# Altium schematic sheet Charger.SchDoc
size A4
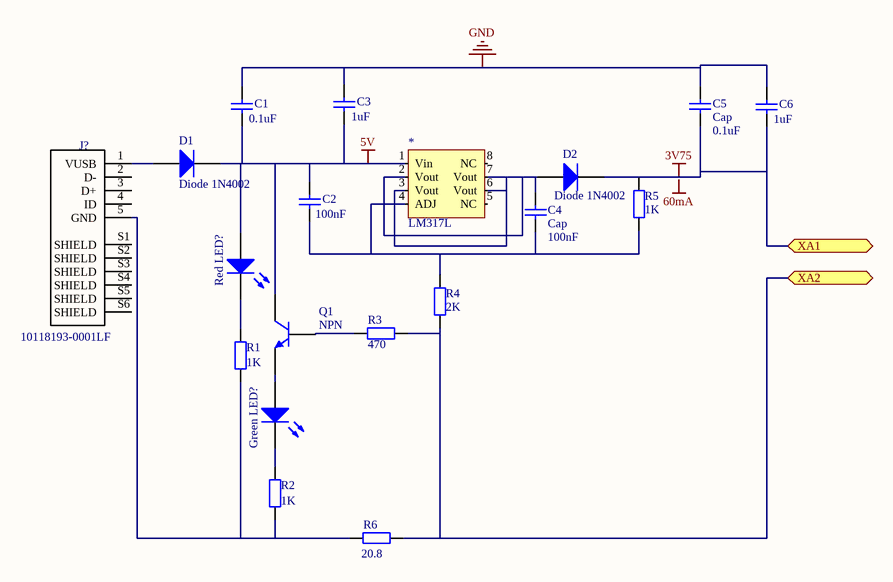
[diagram p0: Charger.SchDoc]

## Parts
*  LM317L  [*SOIC127P600X175-8N]
C1  value 0.1uF  [RAD-0.3]  (hidden comment: Cap)
C2  value 100nF  [RAD-0.3]  (hidden comment: Cap)
C3  value 1uF  [RAD-0.3]  (hidden comment: Cap)
C4  Cap  value 100nF  [RAD-0.3]
C5  Cap  value 0.1uF  [RAD-0.3]
C6  value 1uF  [RAD-0.3]  (hidden comment: Cap)
D1  Diode 1N4002  [DO-41]
D2  Diode 1N4002  [DO-41]
Green_LED?  (no value)  [3.2X1.6X1.1]
J?  10118193-0001LF  [*FCI_10118193-0001LF_10118193-0001LF(Primary)]
Q1  NPN  [*TO-92]
R1  value 1K  [AXIAL-0.4]  (hidden comment: Res2)
R2  value 1K  [AXIAL-0.4]  (hidden comment: Res2)
R3  value 470  [AXIAL-0.4]  (hidden comment: Res2)
R4  value 2K  [AXIAL-0.4]  (hidden comment: Res2)
R5  value 1K  [AXIAL-0.4]  (hidden comment: Res2)
R6  value 20.8  [AXIAL-0.4]  (hidden comment: Res2)
Red_LED?  (no value)  [LED-1]

## Ports
XA1, XA2

## Nets
3V75: C5.1 C6.1 D2.2(K) R5.1 ; port XA1
5V: *.1(Vin) C1.1 C2.2 C3.1 D1.2(K) Q1.1(C) Red_LED?.1(A)
GND: C1.2 C3.2 C5.2 C6.2
XA2: R3.2 R4.2 R6.1 ; port XA2
Net*_2: *.2(Vout) *.3(Vout) *.6(Vout) *.7(Vout) C4.2 D2.1(A)
Net*_4: *.4(ADJ) C2.1 C4.1 R4.1 R5.2
NetD1_1: D1.1(A) J?.1(VUSB)
NetGreen_LED?_1: Green_LED?.1(A) Q1.3(E)
NetGreen_LED?_2: Green_LED?.2(K) R2.2
NetJ?_5: J?.5(GND) R1.1 R2.1 R6.2
NetQ1_2: Q1.2(B) R3.1
NetR1_2: R1.2 Red_LED?.2(K)

Not connected (* = marked no-connect by the designer): * 5(NC) 8(NC); J? 2(D-) 3(D+) 4(ID) S1(SHIELD) S2(SHIELD) S3(SHIELD) S4(SHIELD) S5(SHIELD) S6(SHIELD)

## Notes on the sheet
- Labels drawn without touching a wire or pin: 60mA

## Library data of the parts
C1-C6 = Cap: Capacitor; Published: 8-Jun-2000; LatestRevisionDate: 17-Jul-2002; LatestRevisionNote: Re-released for DXP Platform.; PackageReference: RAD-0.3; Publisher: Altium Limited; PackageDescription: Radial Cap, Thru-Hole; 2 Leads; 0.3 in Pin Spacing
D1 D2 = Diode 1N4002: 1 Amp General Purpose Rectifier; Published: 8-Jun-2000; LatestRevisionDate: 17-Jul-2002; LatestRevisionNote: Re-released for DXP Platform.; DatasheetVersion: 1998; PackageVersion: Aug-1999; PackageReference: DO-41; Publisher: Altium Limited; PackageDescription: Diode, Axial; Body 5.2 x 2.7 mm (LxDia. max), Lead Dia. 0.86 mm (max); Code_JEDEC: DO-204-AL; ComponentLink1Description: Manufacturer Link; ComponentLink1URL: http://www.fairchildsemi.com/; ComponentLink2Description: Datasheet; ComponentLink2URL: http://www.fairchildsemi.com/ds/1N%2F1N4001.pdf
Green_LED? = LED2: Typical RED, GREEN, YELLOW, AMBER GaAs LED; Published: 8-Jun-2000; LatestRevisionDate: 17-Jul-2002; LatestRevisionNote: Re-released for DXP Platform.; PackageVersion: Feb-2002; PackageReference: 3.2X1.6X1.1; Publisher: Altium Limited; PackageDescription: SM LED; 2 Flat Leads
J? = 10118193-0001LF: Single Port 5 Contact Shielded SMT MICRO USB B-Type Receptacle; MF: Amphenol ICC; Availability: Unavailable; SnapEDA_Link: https://www.snapeda.com/parts/10118193-0001LF/Amphenol%20ICC/view-part/?ref=snap; MP: 10118193-0001LF; Price: None; Package: None; Value: *
Q1 = QNPN: NPN Bipolar Transistor; Published: 8-Jun-2000; LatestRevisionDate: 29-May-2009; LatestRevisionNote: IPC-7351 Footprint Added.; PackageVersion: Aug-1999; PackageReference: SOT-23B; Publisher: Altium Limited; PackageDescription: 3-Pin SOT-23 Package 0.95 mm Pitch, 2.4 mm Lead Span
R1-R6 = Res2: Resistor; Published: 8-Jun-2000; LatestRevisionDate: 17-Jul-2002; LatestRevisionNote: Re-released for DXP Platform.; PackageReference: AXIAL-0.4; Publisher: Altium Limited; PackageDescription: Axial Device, Thru-Hole; 2 Leads; 0.4 in Pin Spacing
Red_LED? = LED1: Typical RED GaAs LED; Published: 8-Jun-2000; LatestRevisionDate: 08-Jul-2005; LatestRevisionNote: Mech Layer 1 removed.; PackageReference: LED-1; Publisher: Altium Limited; PackageDescription: LED; 2 Leads